# EasyEDA Pro project AmpBoard64TP.eprj, board Mod8TP_bottom
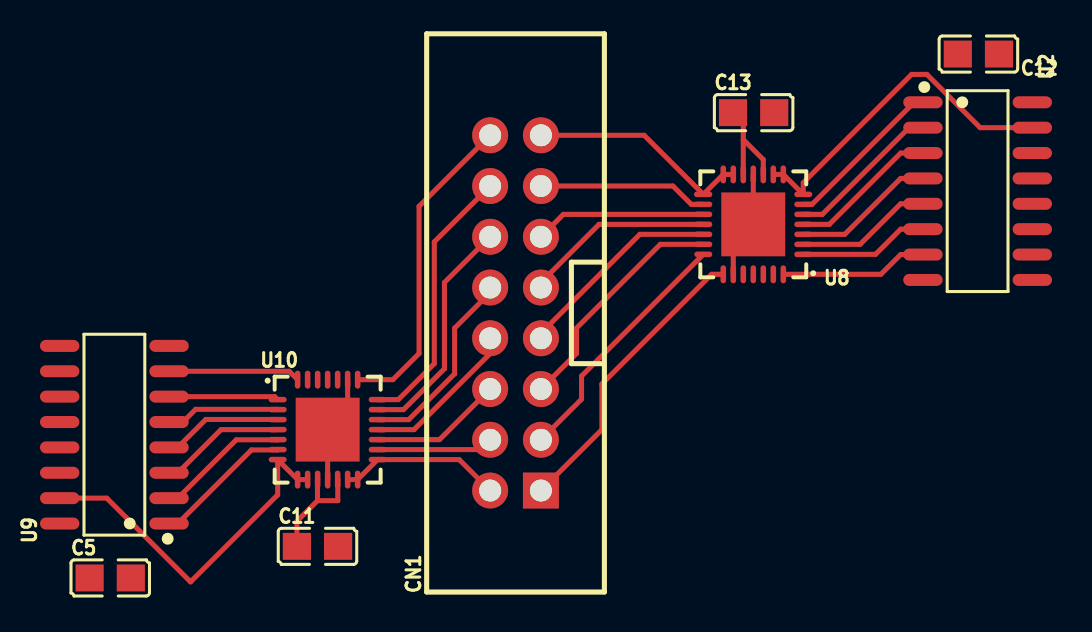
[diagram p7: board, top side]
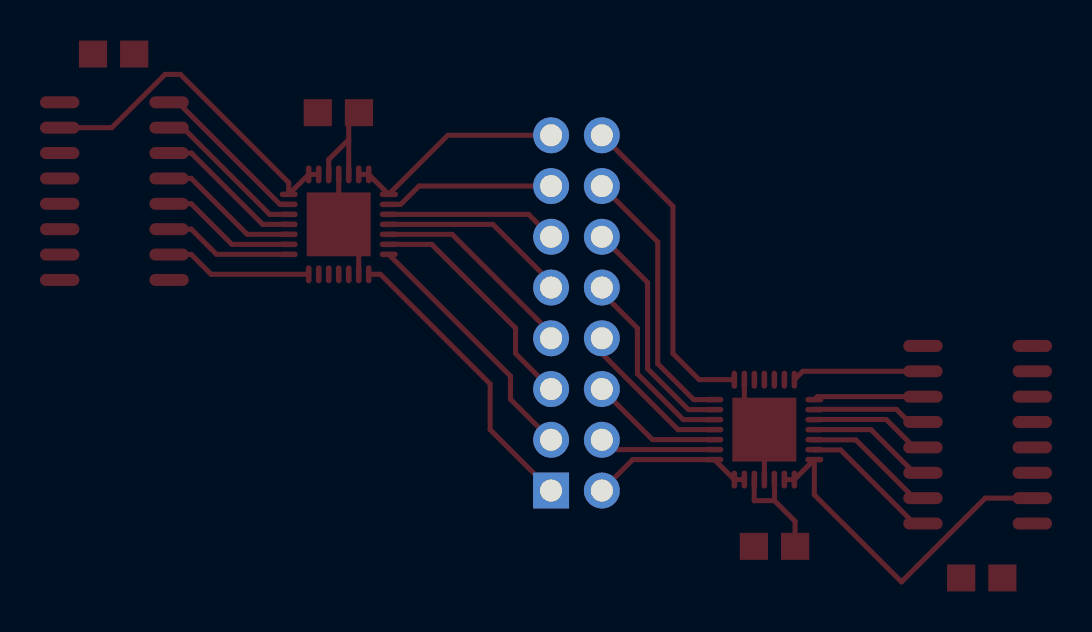
[diagram p8: board, bottom side, seen from below]

No outline. copper layers: Top Layer, Bottom Layer. Coordinates in mm from the lowest, leftmost part position.
Stack: Top Layer 0.035mm / Dielectric1 1.51mm FR4 er 4.5 / Bottom Layer 0.035mm

## Design rules (mm)
template: JLCPCB Capability(Two Layers Board)
spacing copperThickness1oz (default): track to track 0.102, other pairs 0.152 to 0.3
spacing copperThickness2oz: track to track 0.203, other pairs 0.152 to 0.3
track width copperThickness1oz (default): min 0.127, default 0.254, max 2.54
track width copperThickness2oz: min 0.203, default 0.254, max 2.54
differential pair differentialPair (default): width min 0.127, default 0.254, max 2.54; gap min 0.152, default 0.152
via viaSize (default): diameter min 0.5, default 0.61, max 10; hole min 0.3, default 0.305, max 6.3

## Placement (name value [footprint] x y rotation side)
C5  100pF  [C0805]  0 0 0 top
C11  100pF  [C0805]  10.37 1.58 0 top
C12  100pF  [C0805]  43.43 26.22 180 top
C13  100pF  [C0805]  32.18 23.29 0 top
CN1  KH-2.54PH180-2X8P-L8.9  [CONN-TH_16P-P2.54_KINGHELM_KH-2.54PH180-2X8P-L8.9]  20.27 13.27 90 top
U2  74HC595D,118  [SOIC-16_L9.9-W3.9-P1.27-LS6.0-BL]  43.39 19.36 270 top
U8  TPS65190RHDR  [VQFN-28_L5.0-W5.0-P0.50-TL-EP3.2]  32.17 17.7 180 top
U9  74HC595D,118  [SOIC-16_L9.9-W3.9-P1.27-LS6.0-BL]  0.21 7.17 90 top
U10  TPS65190RHDR  [VQFN-28_L5.0-W5.0-P0.50-TL-EP3.2]  10.88 7.42 0 top

## Footprints (pads in the part's own frame, mm; a bottom-side part is the same pattern mirrored in y, then rotated)
C0805
  rect 1.41x1.35 smd: 1(-1.03,0) 2(1.03,0)
CONN-TH_16P-P2.54_KINGHELM_KH-2.54PH180-2X8P-L8.9
  rect 1.8x1.8 hole 1.1: 1(-8.89,-1.27)
  round 1.8 hole 1.1: 2(-8.89,1.27) 3(-6.35,-1.27) 4(-6.35,1.27) 5(-3.81,-1.27) 6(-3.81,1.27) 7(-1.27,-1.27) 8(-1.27,1.27) 9(1.27,-1.27) 10(1.27,1.27) 11(3.81,-1.27) 12(3.81,1.27) 13(6.35,-1.27) 14(6.35,1.27) 15(8.89,-1.27) 16(8.89,1.27)
SOIC-16_L9.9-W3.9-P1.27-LS6.0-BL
  oval 0.602x1.971 smd: 1(-4.445,-2.736) 2(-3.175,-2.736) 3(-1.905,-2.736) 4(-0.635,-2.736) 5(0.635,-2.736) 6(1.905,-2.736) 7(3.175,-2.736) 8(4.445,-2.736) 9(4.445,2.736) 10(3.175,2.736) 11(1.905,2.736) 12(0.635,2.736) 13(-0.635,2.736) 14(-1.905,2.736) 15(-3.175,2.736) 16(-4.445,2.736)
VQFN-28_L5.0-W5.0-P0.50-TL-EP3.2
  oval 0.9x0.28 smd: 1(-2.5,1.502) 2(-2.5,1.001) 3(-2.5,0.5) 4(-2.5,0) 5(-2.5,-0.5) 6(-2.5,-1) 7(-2.5,-1.501) 15(2.5,-1.501) 16(2.5,-1) 17(2.5,-0.5) 18(2.5,0) 19(2.5,0.5) 20(2.5,1.001) 21(2.5,1.502)
  oval 0.28x0.9 smd: 8(-1.502,-2.5) 9(-1.001,-2.5) 10(-0.5,-2.5) 11(0,-2.5) 12(0.5,-2.5) 13(1,-2.5) 14(1.501,-2.5) 22(1.501,2.5) 23(1,2.5) 24(0.5,2.5) 25(0,2.5) 26(-0.5,2.5) 27(-1.001,2.5) 28(-1.502,2.5)
  rect 3.2x3.2 smd: 29(0,0)

## Nets
As in the schematic.

Pads without a net: U2 9; U8 24 25 26 27; U9 9; U10 24 25 26 27

## Routing (per net, layer and track width the routed paths; a pad name or vN(x,y) marks a point on that pad's centre or on a via; arc(x,y) is an arc through that point)
GND: length 10.8
  Top Layer w0.254: U8.11 U8.29 31.17,16.7 U8.23 ; U10.23 11.88,8.42 U10.29 U10.11
VCC: length 11.3
  Top Layer w0.254: 10.37,3.87 9.34,2.84 C11.1 ; 10.37,3.87 11.38,3.87 11.38,4.92 U10.12 ; 10.37,3.87 10.37,4.92 U10.10 ; C13.1 31.67,22.78 31.67,21.94 ; 31.67,21.94 U8.12 ; 31.67,21.94 32.67,20.94 U8.10
$1N787: length 8.5
  Top Layer w0.254: U8.16 29.07,18.7 28.15,19.62 CN1.13
$1N791: length 8.6
  Top Layer w0.254: CN1.11 22.67,18.2 U8.17
$1N795: length 9.6
  Top Layer w0.254: U8.18 24.45,17.7 21.54,14.79 CN1.9
$1N799: length 10.4
  Top Layer w0.254: U8.19 26.49,17.2 21.54,12.25 CN1.7
$1N803: length 11.9
  Top Layer w0.254: U8.20 27.52,16.7 23.32,12.5 23.32,11.23 CN1.5
$1N807: length 12.6
  Top Layer w0.254: CN1.3 23.58,8.95 23.58,10.11 U8.21
$1N811: length 14.9
  Top Layer w0.254: CN1.1 24.59,7.42 24.59,9.71 30.08,15.2 U8.22
$1N815: length 11.6
  Top Layer w0.254: U8.15 29.33,19.2 ; U8.15 26.71,22.16 CN1.15 ; U8.15 U8.14 U8.13
$1N826: length 17.3
  Top Layer w0.254: U8.9 U8.8 U8.7 34.67,19.78 40.09,25.2 40.85,25.2 43.52,22.54 U2.15
$1N837: length 8.1
  Top Layer w0.254: U2.1 40.21,23.81 35.1,18.7 U8.6
$1N841: length 7.8
  Top Layer w0.254: U8.5 35.62,18.2 39.96,22.54 U2.2
$1N845: length 7.5
  Top Layer w0.254: U2.3 39.54,21.27 35.97,17.7 U8.4
$1N849: length 7.1
  Top Layer w0.254: 40.65,20 39.54,20 36.74,17.2 U8.3
$1N853: length 6.8
  Top Layer w0.254: U8.2 37.51,16.7 39.54,18.73 U2.5
$1N857: length 6.5
  Top Layer w0.254: U8.1 38.28,16.2 39.54,17.46 U2.6
$1N861: length 7.4
  Top Layer w0.254: U8.28 38.55,15.2 39.54,16.19 U2.7
$1N888: length 5.8
  Top Layer w0.254: CN1.4 18.51,6.42 U10.16
$1N892: length 6.7
  Top Layer w0.254: U10.17 16.47,6.92 CN1.6
$1N896: length 8
  Top Layer w0.254: CN1.8 19,11.23 15.19,7.42 U10.18
$1N900: length 9.9
  Top Layer w0.254: CN1.10 19,14.28 17.23,12.5 17.23,10.22 14.93,7.92 U10.19
$1N904: length 11.7
  Top Layer w0.254: U10.20 14.67,8.42 16.72,10.47 16.72,14.79 CN1.12
$1N908: length 13.6
  Top Layer w0.254: CN1.14 16.21,16.82 16.21,10.73 14.41,8.93 U10.21
$1N912: length 16
  Top Layer w0.254: U10.22 14.14,9.92 15.45,11.23 15.45,18.6 CN1.16
$1N916: length 8.2
  Top Layer w0.254: U10.13 U10.14 13.38,5.92 17.46,5.92 CN1.2
$1N927: length 18.1
  Top Layer w0.254: U10.9 U10.8 8.38,5.92 8.38,4.16 4.02,-0.2 -0.17,3.99 U9.15
$1N938: length 7
  Top Layer w0.254: U9.1 3.38,2.72 7.07,6.41 8.36,6.41 U10.6
$1N942: length 6.6
  Top Layer w0.254: U9.2 3.38,3.99 6.3,6.92 8.37,6.92 U10.5
$1N946: length 6.3
  Top Layer w0.254: U10.4 5.54,7.42 3.38,5.26 U9.3
$1N950: length 6
  Top Layer w0.254: U10.3 8.37,7.93 4.78,7.93 3.38,6.53 U9.4
$1N954: length 5.7
  Top Layer w0.254: U10.2 8.36,8.44 4.27,8.44 3.64,7.8 U9.5
$1N958: length 5.5
  Top Layer w0.254: U10.1 8.23,9.07 U9.6
$1N962: length 6.6
  Top Layer w0.254: U9.7 8.95,10.34 U10.28
